# Altium schematic sheet Urukul_DIOT_Connectors_P1_P6.SchDoc: Fastino
size 420 x 297 mm; SPICEModelCacheRMUUFYQV: <root> / <DocumentId>RMUUFYQV</DocumentId> / <CacheFrame Number="0"> / <Model Name="kpp" Kind="GlobalParam"> / <Text>.param KPP = 3.0E-05</Text> / </Model> / <Model Name="ldp" Kind="GlobalParam"> / <Text>.param LDP = 0.07U</Text> / </Model> / <Model Name="vtop" Kind="GlobalParam"> / <Text>.param VTOP = 0.14</Text> / </Model> / <Model Name="rpar" Kind="GlobalParam"> / <Text>.param RPAR = 1T</Text> / </Model> / <Model Name="cbdj" Kind="GlobalParam"> / <Text>.param CBDJ = 1</Text> / </Model> / <Model Name="cn" Kind="GlobalParam"> / <Text>.param CN = 0.8</Text> / </Model> / <Model Name="cjp" Kind="GlobalParam"> / <Text>.param CJP = CN*300U</Text> / <Dependency>0\cn</Dependency> / </Model> / <Model Name="ls" Kind="GlobalParam"> / <Text>.param LS = 1.0U</Text> / </Model> / <Model Name="cbds" Kind="GlobalParam"> / <Text>.param CBDS = 1</Text> / </Model> / <Model Name="cjswp" Kind="GlobalParam"> / <Text>.param CJSWP = CN*2.2N</Text> / <Dependency>0\cn</Dependency> / </Model> / <Model Name="epssio2" Kind="GlobalParam"> / <Text>.param EPSSIO2 = 3.9*8.854214871E-12</Text> / </Model> / <Model Name="tox" Kind="GlobalParam"> / <Text>.param TOX = 1000E-10</Text> / </Model> / <Model Name="cox" Kind="GlobalParam"> / <Text>.param COX = EPSSIO2/TOX</Text> / <Dependency>0\epssio2</Dependency> / <Dependency>0\tox</Dependency> / </Model> / <Model Name="xjn" Kind="GlobalParam"> / <Text>.param XJN = 0.2U</Text> / </Model> / <Model Name="cgsop" Kind="GlobalParam"> / <Text>.param CGSOP = CN*0.6 * XJN * COX</Text> / <Dependency>0\cn</Dependency> / <Dependency>0\xjn</Dependency> / <Dependency>0\cox</Dependency> / </Model> / <Model Name="cgdop" Kind="GlobalParam"> / <Text>.param CGDOP = CGSOP</Text> / <Dependency>0\cgsop</Dependency> / </Model> / <Model Name="isz" Kind="GlobalParam"> / <Text>.param ISZ = 5P</Text> / </Model> / <Model Name="kpn" Kind="GlobalParam"> / <Text>.param KPN = 6.0E-05</Text> / </Model> / <Model Name="ldn" Kind="GlobalParam"> / <Text>.param LDN = 0.07U</Text> / </Model> / <Model Name="rsw" Kind="GlobalParam"> / <Text>.param RSW = 1810</Text> / </Model> / <Model Name="rsn" Kind="GlobalParam"> / <Text>.param RSN = 1.41</Text> / </Model> / <Model Name="vbmul" Kind="GlobalParam"> / <Text>.param VBMUL = 1E6</Text> / </Model> / <Model Name="vtohp" Kind="GlobalParam"> / <Text>.param VTOHP = 0.85</Text> / </Model> / <Model Name="lambda" Kind="GlobalParam"> / <Text>.param LAMBDA = 2M</Text> / </Model> / <Model Name="vtohn" Kind="GlobalParam"> / <Text>.param VTOHN = 0.80</Text> / </Model> / <Model Name="ibias" Kind="CKT"> / <Text>* / .SUBCKT IBIAS VCC GND VIB / * / .PARAM M1 = 8 / .PARAM M2 = 5 / .PARAM MP = 1 / .PARAM WP = 13U / .PARAM WN = 130U / .PARAM LPE = {36U - LDP} / .PARAM LNE = {13U - LDN} / .PARAM BP = {MP*(WP/LPE)*(KPP/2)} / .PARAM WW = 13U / .PARAM LW = 213U / .PARAM WNN = 25U / .PARAM LNN = 87U / .PARAM R1 = {(RSW*LW/WW + RSN*LNN/WNN)} / .PARAM K2 = {M2*(WN/LNE)*(KPN/2)} / .PARAM MR = {M2/M1} / * / R1 VIB GND {VBMUL} / GB  VCC VIB  VALUE = {LIMIT( IF ( V(VCC,GND) &gt; VTOHP, BP*PWR(V(VCC,GND)-VTOHP, 2), 0), / + (1 + 1*LAMBDA*(V(VCC,GND) - VTOHN))*PWR(( 1 - SQRT(MR/(1+2*LAMBDA*(V(VCC,GND) - VTOHP))) )/R1, 2)/K2, 0)} / R2 VIB VCC {RPAR} / .ENDS</Text> / <Dependency>0\kpp</Dependency> / <Dependency>0\kpn</Dependency> / <Dependency>0\ldn</Dependency> / <Dependency>0\ldp</Dependency> / <Dependency>0\rsw</Dependency> / <Dependency>0\rsn</Dependency> / <Dependency>0\vbmul</Dependency> / <Dependency>0\vtohp</Dependency> / <Dependency>0\lambda</Dependency> / <Dependency>0\vtohn</Dependency> / <Dependency>0\rpar</Dependency> / </Model> / <Model Name="vton" Kind="GlobalParam"> / <Text>.param VTON = 0.14</Text> / </Model> / <Model Name="cjn" Kind="GlobalParam"> / <Text>.param CJN = CN*180U</Text> / <Dependency>0\cn</Dependency> / </Model> / <Model Name="cjswn" Kind="GlobalParam"> / <Text>.param CJSWN = CN*1N</Text> / <Dependency>0\cn</Dependency> / </Model> / <Model Name="cgson" Kind="GlobalParam"> / <Text>.param CGSON = CN*0.6 * XJN * COX</Text> / <Dependency>0\cn</Dependency> / <Dependency>0\xjn</Dependency> / <Dependency>0\cox</Dependency> / </Model> / <Model Name="cgdon" Kind="GlobalParam"> / <Text>.param CGDON = CGSON</Text> / <Dependency>0\cgson</Dependency> / </Model> / <Model Name="tlc55x_rwelld" Kind="CKT"> / <Text>*$ / .SUBCKT TLC55X_RWELLD  1 2 PARAMS: W = 10U L = 100U / R1 1 2 {RSW*L/W} / .ENDS</Text> / <Dependency>0\rsw</Dependency> / </Model> / <Model Name="tlc55x_rwell" Kind="CKT"> / <Text>*+ RSH= 10 / *$ / .SUBCKT TLC55X_RWELL  1 2 PARAMS: W = 10U L = 100U / XR1 1 2 TLC55X_RWELLD PARAMS: W = {W} L = {L} / .ENDS</Text> / <Dependency>0\tlc55x_rwelld</Dependency> / </Model> / <Model Name="mdswn" Kind="CKT"> / <Text>.SUBCKT MDSWN D S DG GND PARAMS: W = 100U L = 10U M = 1 / * / .PARAM LE = {L - LDN} / * / S1 D S DG GND SWN / C1 D S {M*(CBDJ*CJN*LS*W + CBDS*CJSWN*(2*LS + W))} / *D B / .MODEL SWN VSWITCH ( VON = {0.55} VOFF = {0.49} RON={1/(2*M*(W/LE)*(KPN/2)*10)} ROFF={1G} ) / .ENDS</Text> / <Dependency>0\kpn</Dependency> / <Dependency>0\ldn</Dependency> / <Dependency>0\cbdj</Dependency> / <Dependency>0\cjn</Dependency> / <Dependency>0\ls</Dependency> / <Dependency>0\cbds</Dependency> / <Dependency>0\cjswn</Dependency> / </Model> / <Model Name="ccg" Kind="GlobalParam"> / <Text>.param CCG = 0.2</Text> / </Model> / <Model Name="xjncg" Kind="GlobalParam"> / <Text>.param XJNCG = 0.2U</Text> / </Model> / <Model Name="toxcg" Kind="GlobalParam"> / <Text>.param TOXCG = 1000E-10</Text> / </Model> / <Model Name="coxcg" Kind="GlobalParam"> / <Text>.param COXCG = EPSSIO2/TOXCG</Text> / <Dependency>0\epssio2</Dependency> / <Dependency>0\toxcg</Dependency> / </Model> / <Model Name="cgsoncg" Kind="GlobalParam"> / <Text>.param CGSONCG = CCG*0.6 * XJNCG * COXCG</Text> / <Dependency>0\ccg</Dependency> / <Dependency>0\xjncg</Dependency> / <Dependency>0\coxcg</Dependency> / </Model> / <Model Name="cgdoncg" Kind="GlobalParam"> / <Text>.param CGDONCG = CGSONCG</Text> / <Dependency>0\cgsoncg</Dependency> / </Model> / <Model Name="cjncg" Kind="GlobalParam"> / <Text>.param CJNCG = CCG*180U</Text> / <Dependency>0\ccg</Dependency> / </Model> / <Model Name="cjswncg" Kind="GlobalParam"> / <Text>.param CJSWNCG = CCG*1N</Text> / <Dependency>0\ccg</Dependency> / </Model> / <Model Name="vtomp" Kind="GlobalParam"> / <Text>.param VTOMP = 0.6</Text> / </Model> / <Model Name="tlc55x_pmosd_mv" Kind="MDL"> / <Text>*$ / .MODEL TLC55X_PMOSD_MV PMOS LEVEL=1 L=10U W=100U KP={KPP} VTO={-VTOMP} LAMBDA=2E-3 / *+ CJ={CJP} CJSW={CJSWP} CGSO={CGSOP} CGDO={CGDOP} PB=0.65 LD=70N TOX={TOX} / + CJ={CJNCG} CJSW={CJSWNCG} CGSO={CGSONCG} CGDO={CGDONCG} PB=0.65 LD= 70N TOX={TOXCG}</Text> / <Dependency>0\cgdoncg</Dependency> / <Dependency>0\cgsoncg</Dependency> / <Dependency>0\cjncg</Dependency> / <Dependency>0\cjswncg</Dependency> / <Dependency>0\kpp</Dependency> / <Dependency>0\toxcg</Dependency> / <Dependency>0\vtomp</Dependency> / </Model> / <Model Name="tlc55x_pmos_mv" Kind="CKT"> / <Text>*$ / .SUBCKT TLC55X_PMOS_MV  D G S B PARAMS: W = 100U L = 10U M = 1 / M1 D G S B TLC55X_PMOSD_MV W = {W} L = {L} M = {M} AD={W*LS} AS={W*LS} PD={W + 2*LS} PS={W + 2*LS} / + NRD={LS/W} NRS={LS/W} / .ENDS</Text> / <Dependency>0\tlc55x_pmosd_mv</Dependency> / <Dependency>0\ls</Dependency> / </Model> / <Model Name="mdswp" Kind="CKT"> / <Text>.SUBCKT MDSWP D S DG GND PARAMS: W = 100U L = 10U M = 1 / * / .PARAM LE = {L - LDP} / * / S1 D S DG GND SWN / C1 D S {M*(CBDJ*CJP*LS*W + CBDS*CJSWP*(2*LS + W))} / *D B / .MODEL SWN VSWITCH ( VON = {0.49} VOFF = {0.55} RON={1/(2*M*(W/LE)*(KPP/2)*10)} ROFF={1G} ) / .ENDS</Text> / <Dependency>0\kpp</Dependency> / <Dependency>0\ldp</Dependency> / <Dependency>0\cbdj</Dependency> / <Dependency>0\cjp</Dependency> / <Dependency>0\ls</Dependency> / <Dependency>0\cbds</Dependency> / <Dependency>0\cjswp</Dependency> / </Model> / <Model Name="comp2inpnorsd" Kind="CKT"> / <Text>.SUBCKT COMP2INPNORSD IN1+ IN1- IN2+ IN2- OUT GND / + PARAMS: ROUT=0 DELAYLH=0 DELAYHL=0 VOUTH=0 VOUTL=0 VTHRES1=0 VTHRES2=0 / * / .PARAM TDELLH = {IF ( (DELAYLH &lt; 1E-9) , 1E-9, DELAYLH ) } / .PARAM TDELHL = {IF ( (DELAYHL &lt; 1E-9) , 1E-9, DELAYHL ) } / .PARAM RO = {IF ( (TDEL &gt; 1E-15) &amp; (ROUT &lt; 1), 1, ROUT ) } / .PARAM TDEL = {(TDELLH+TDELHL)/2} / .PARAM COUT={TDEL/(0.693*(RO+1U))} / .PARAM RDELLH = {TDELLH/(0.693*(COUT+1F))} / .PARAM RDELHL = {TDELHL/(0.693*(COUT+1F))} / EOUT OUT GND VALUE= { IF ( (V(IN1+,IN1-) &gt; {VTHRES1}) | (V(IN2+,IN2-) &gt; {VTHRES2}), / + VOUTL + RDELLH*I(EOUT), VOUTH + RDELHL*I(EOUT) ) } / COUT OUT GND {COUT} / .ENDS COMP2INPNORSD</Text> / </Model> / <Model Name="comp3inpnorsd" Kind="CKT"> / <Text>.SUBCKT COMP3INPNORSD IN1+ IN1- IN2+ IN2- IN3+ IN3- OUT VCC GND / + PARAMS: ROUT=0 DELAYLH=0 DELAYHL=0 VOUTH=0 VOUTL=0 VTHRES1=0 VHYST1=0 VTHRES2=0 VHYST2=0 VTHRES3=0 VHYST3=0 / * / .PARAM TDELLH = {IF ( (DELAYLH &lt; 1E-9) , 1E-9, DELAYLH ) } / .PARAM TDELHL = {IF ( (DELAYHL &lt; 1E-9) , 1E-9, DELAYHL ) } / .PARAM RO = {IF ( (TDEL &gt; 1E-15) &amp; (ROUT &lt; 1), 1, ROUT ) } / .PARAM TDEL = {(TDELLH+TDELHL)/2} / .PARAM COUT={TDEL/(0.693*(RO+1U))} / .PARAM VREFN = {(15-VTOHN)} / .PARAM VREFP = {(15-VTOHP)} / .PARAM RDELLH = {TDELLH/(0.693*(COUT+1F))*VREFP} / .PARAM RDELHL = {TDELHL/(0.693*(COUT+1F))*VREFN} / * / EOUT OUT GND VALUE= { IF ( (V(IN1+,IN1-) &gt; {VTHRES1}) | (V(IN2+,IN2-) &gt; {VTHRES2}) | (V(IN3+,IN3-) &gt; {VTHRES3}), / + VOUTL + RDELLH*I(EOUT)*V(1,GND), VOUTH + RDELHL*I(EOUT)*V(1,GND) ) } / E1 1 GND VALUE= { IF ( (V(VCC,GND) &gt; {VTOHP+0.01}), 1/(V(VCC,GND)-VTOHP), 100 ) } / COUT OUT GND {COUT} / .ENDS COMP3INPNORSD</Text> / <Dependency>0\vtohn</Dependency> / <Dependency>0\vtohp</Dependency> / </Model> / <Model Name="rr1sff" Kind="CKT"> / <Text>.SUBCKT RR1SFF S R R1 Q  Q_ VCC GND / + PARAMS: VOUTH=5.0 VOUTL=0 RIN=1E12 DELAY=10N ROUT=10 / .PARAM W1 = 100U / .PARAM L1 = 10U / .PARAM W2 = 100U / .PARAM L2= 10U / .PARAM W3 = 10U / .PARAM L3 = 25U / .PARAM W4 = 10U / .PARAM L4= 100U / * / XU1     Q GND S GND Q_ GND   COMP2INPNORSD / + PARAMS: ROUT={ROUT} DELAYLH={1N} DELAYHL={1N} VOUTH={VOUTH} VOUTL={VOUTL} / + VTHRES1={0.5*(VOUTH-VOUTL)} VTHRES2={VTOCN} / XU2     VCC R R1 GND Q_ GND Q VCC GND   COMP3INPNORSD / + PARAMS: ROUT={ROUT} DELAYLH={15N} DELAYHL={1N} VOUTH={VOUTH} VOUTL={VOUTL} / + VTHRES1={VTOCP} VTHRES2={VTOCN} VTHRES3={0.49*(VOUTH-VOUTL)} / *C1 S GND {0.5*COX*(W1*L1) + CGSON*W1} / *C2 R VCC {0.5*COX*(W2*L2) + CGSOP*W2} / *C3 R1 GND {0.5*COX*(W3*L3) + CGSON*W3} / *C4 R1 VCC {0.5*COX*(W4*L4) + CGSOP*W4} / .ENDS</Text> / <Dependency>0\comp2inpnorsd</Dependency> / <Dependency>0\comp3inpnorsd</Dependency> / </Model> / <Model Name="vtomn" Kind="GlobalParam"> / <Text>.param VTOMN = 0.55</Text> / </Model> / <Model Name="tlc55x_nmosd_mv" Kind="MDL"> / <Text>*$ / .MODEL TLC55X_NMOSD_MV NMOS LEVEL=1 L=10U W=100U KP={KPN} VTO={VTOMN} LAMBDA=2E-3 / + CJ={CJNCG} CJSW={CJSWNCG} CGSO={CGSONCG} CGDO={CGDONCG} PB=0.65 LD= 70N TOX={TOXCG}</Text> / <Dependency>0\cgdoncg</Dependency> / <Dependency>0\cgsoncg</Dependency> / <Dependency>0\cjncg</Dependency> / <Dependency>0\cjswncg</Dependency> / <Dependency>0\kpn</Dependency> / <Dependency>0\toxcg</Dependency> / <Dependency>0\vtomn</Dependency> / </Model> / <Model Name="tlc55x_nmos_mv" Kind="CKT"> / <Text>*$ / .SUBCKT TLC55X_NMOS_MV  D G S B PARAMS: W = 100U L = 10U M = 1 / M1 D G S B TLC55X_NMOSD_MV W = {W} L = {L} M = {M} AD={W*LS} AS={W*LS} PD={W + 2*LS} PS={W + 2*LS} / + NRD={LS/W} NRS={LS/W} / .ENDS</Text> / <Dependency>0\tlc55x_nmosd_mv</Dependency> / <Dependency>0\ls</Dependency> / </Model> / <Model Name="mswn" Kind="CKT"> / <Text>.SUBCKT MSWN D G S PARAMS: W = 100U L = 10U M = 1 / * / .PARAM LE = {L - LDN} / * / *C1 D S {M*(CBDJ*CJN*LS*W + CBDS*CJSWN*(2*LS + W))} / *D B / *C2 G S {M*2/3*COX*(W*LE) + CGSON*W} / *C3 G D {CGDON*W} / S1 D S G S SWN / .MODEL SWN VSWITCH ( VON = {VTON+1} VOFF = {VTON} RON={1/(2*M*(W/L)*(KPN/2)*10)} ROFF={1G} ) / .ENDS</Text> / <Dependency>0\vton</Dependency> / <Dependency>0\kpn</Dependency> / <Dependency>0\ldn</Dependency> / </Model> / <Model Name="tlc55x_nmosd_hv" Kind="MDL"> / <Text>*$ / .MODEL TLC55X_NMOSD_HV NMOS LEVEL=3 L=10U W=100U KP={KPN} VTO={VTOHN} LAMBDA=2E-3 THETA=1.8E-01 / + CJ={CJN} CJSW={CJSWN} CGSO={CGSON} CGDO={CGDON} RSH= 10 PB=0.65 LD= 70N TOX={TOX}</Text> / <Dependency>0\cgdon</Dependency> / <Dependency>0\cgson</Dependency> / <Dependency>0\cjn</Dependency> / <Dependency>0\cjswn</Dependency> / <Dependency>0\kpn</Dependency> / <Dependency>0\tox</Dependency> / <Dependency>0\vtohn</Dependency> / </Model> / <Model Name="tlc55x_nmos_hv" Kind="CKT"> / <Text>.SUBCKT TLC55X_NMOS_HV  D G S B PARAMS: W = 100U L = 10U M = 1 / M1 D G S B TLC55X_NMOSD_HV W = {W} L = {L} M = {M} AD={W*LS} AS={W*LS} PD={W + 2*LS} PS={W + 2*LS} / + NRD={LS/W} NRS={LS/W} / .ENDS</Text> / <Dependency>0\tlc55x_nmosd_hv</Dependency> / <Dependency>0\ls</Dependency> / </Model> / <Model Name="tlc55x_pmosd_hv" Kind="MDL"> / <Text>*$ / .MODEL TLC55X_PMOSD_HV PMOS LEVEL=3 L=10U W=100U KP={KPP} VTO={-VTOHP} LAMBDA=2E-3 THETA=2.2E-01 / + CJ={CJP} CJSW={CJSWP} CGSO={CGSOP} CGDO={CGDOP} RSH=10 PB=0.65 LD=70N TOX={TOX}</Text> / <Dependency>0\cgdop</Dependency> / <Dependency>0\cgsop</Dependency> / <Dependency>0\cjp</Dependency> / <Dependency>0\cjswp</Dependency> / <Dependency>0\kpp</Dependency> / <Dependency>0\tox</Dependency> / <Dependency>0\vtohp</Dependency> / </Model> / <Model Name="tlc55x_pmos_hv" Kind="CKT"> / <Text>*+ RSH= 10 / *$ / .SUBCKT TLC55X_PMOS_HV  D G S B PARAMS: W = 100U L = 10U M = 1 / M1 D G S B TLC55X_PMOSD_HV W = {W} L = {L} M = {M} AD={W*LS} AS={W*LS} PD={W + 2*LS} PS={W + 2*LS} / + NRD={LS/W} NRS={LS/W} / .ENDS</Text> / <Dependency>0\tlc55x_pmosd_hv</Dependency> / <Dependency>0\ls</Dependency> / </Model> / <Model Name="tlc55x_nmosd_hv_l1" Kind="MDL"> / <Text>*$ / .MODEL TLC55X_NMOSD_HV_L1 NMOS LEVEL=1 L=10U W=100U KP={KPN} VTO={VTOHN} LAMBDA=2E-3 / + CJ={CJN} CJSW={CJSWN} CGSO={CGSON} CGDO={CGDON} RSH= 10 PB=0.65 LD= 70N TOX={TOX}</Text> / <Dependency>0\cgdon</Dependency> / <Dependency>0\cgson</Dependency> / <Dependency>0\cjn</Dependency> / <Dependency>0\cjswn</Dependency> / <Dependency>0\kpn</Dependency> / <Dependency>0\tox</Dependency> / <Dependency>0\vtohn</Dependency> / </Model> / <Model Name="tlc55x_nmos_hv_l1" Kind="CKT"> / <Text>*$ / .SUBCKT TLC55X_NMOS_HV_L1  D G S B PARAMS: W = 100U L = 10U M = 1 / M1 D G S B TLC55X_NMOSD_HV_L1 W = {W} L = {L} M = {M} AD={W*LS} AS={W*LS} PD={W + 2*LS} PS={W + 2*LS} / + NRD={LS/W} NRS={LS/W} / .ENDS</Text> / <Dependency>0\tlc55x_nmosd_hv_l1</Dependency> / <Dependency>0\ls</Dependency> / </Model> / <Model Name="tlc55x_pmosd_lv" Kind="MDL"> / <Text>*+ RSH= 10 / *$ / .MODEL TLC55X_PMOSD_LV PMOS LEVEL=1 L=10U W=100U KP={KPP} VTO={-VTOP} LAMBDA=2E-3 / + CJ={CJP} CJSW={CJSWP} CGSO={CGSOP} CGDO={CGDOP}  PB=0.65 LD=300N TOX={TOX}</Text> / <Dependency>0\cgdop</Dependency> / <Dependency>0\cgsop</Dependency> / <Dependency>0\cjp</Dependency> / <Dependency>0\cjswp</Dependency> / <Dependency>0\kpp</Dependency> / <Dependency>0\tox</Dependency> / <Dependency>0\vtop</Dependency> / </Model> / <Model Name="tlc55x_pmos_lv" Kind="CKT"> / <Text>*$ / .SUBCKT TLC55X_PMOS_LV  D G S B PARAMS: W = 100U L = 10U M = 1 / M1 D G S B TLC55X_PMOSD_LV W = {W} L = {L} M = {M} AD={W*LS} AS={W*LS} PD={W + 2*LS} PS={W + 2*LS} / + NRD={LS/W} NRS={LS/W} / .ENDS</Text> / <Dependency>0\tlc55x_pmosd_lv</Dependency> / <Dependency>0\ls</Dependency> / </Model> / <Model Name="pk14" Kind="CKT"> / <Text>*.INC dhvqfn.s / .SUBCKT pk14 / +    1   2   3   4   5   6   7   8   9  10 / +   11  12  13  14 / +   15  16  17  18  19  20  21  22  23  24 / +   25  26  27  28 / * Pin Resistance / r1 1 1001 9.078E-02 / r2 2 1002 8.829E-02 / r3 3 1003 8.731E-02 / r4 4 1004 8.710E-02 / r5 5 1005 8.731E-02 / r6 6 1006 8.829E-02 / r7 7 1007 9.075E-02 / r8 8 1008 9.072E-02 / r9 9 1009 8.809E-02 / r10 10 1010 8.716E-02 / r11 11 1011 8.706E-02 / r12 12 1012 8.720E-02 / r13 13 1013 8.816E-02 / r14 14 1014 9.068E-02 / * Pin Inductance / l1 1001 15 2.981E-09 / l2 1002 16 2.447E-09 / l3 1003 17 2.304E-09 / l4 1004 18 2.291E-09 / l5 1005 19 2.307E-09 / l6 1006 20 2.449E-09 / l7 1007 21 2.971E-09 / l8 1008 22 2.972E-09 / l9 1009 23 2.425E-09 / l10 1010 24 2.286E-09 / l11 1011 25 2.280E-09 / l12 1012 26 2.286E-09 / l13 1013 27 2.425E-09 / l14 1014 28 2.975E-09 / .ENDS pk14</Text> / </Model> / <Model Name="vt" Kind="GlobalParam"> / <Text>.param VT = 1.380649e-23*(273.15+TEMP)/1.60217662e-19</Text> / </Model> / </CacheFrame> / <CacheFrame Number="1"> / <Model Name="iimirrp" Kind="CKT"> / <Text>.SUBCKT IIMIRRP VCC IO II PARAMS: W1 = 100U L1 = 10U M1 = 1 W2 = 100U L2= 10U M2 = 2 IDIN = 1U / * / .PARAM L1E = {L1 - LDP} / .PARAM L2E = {L2 - LDP} / .PARAM B1 = {M1*(W1/L1)*(KPP/2)} / .PARAM MR = {M2*W2/L2E/(M1*W1/L1E)} / .PARAM RDS = {1/(2*SQRT(M2*(W2/L2E)*(KPP/2)*IDIN))} / .PARAM IS = 1E-12 / .PARAM NP = {VTOP/(VT*Log(1 + IDIN/IS))} / * / FB VCC IO V1 {MR} / R1 VCC IO {RPAR} / C1 VCC IO {M2*(CBDJ*CJP*LS*W2 + CBDS*CJSWP*(2*LS + W2))} / D1 IO  10  DMODP / V1 VCC 10 {VTOP} / R2 II 10  {RDS} / C2 VCC II {M1*(CBDJ*CJP*LS*W1 + CBDS*CJSWP*(2*LS + W1)) + 2/3*COX*(M1*W1*L1E + M2*W2*L2E) + M1*CGSOP*W1} / C3 II IO {CGDOP*W2} / .MODEL DMODP D (IS={IS} N={NP} ) / .ENDS</Text> / <Dependency>0\kpp</Dependency> / <Dependency>0\ldp</Dependency> / <Dependency>0\vtop</Dependency> / <Dependency>0\vt</Dependency> / <Dependency>0\rpar</Dependency> / <Dependency>0\cbdj</Dependency> / <Dependency>0\cjp</Dependency> / <Dependency>0\ls</Dependency> / <Dependency>0\cbds</Dependency> / <Dependency>0\cjswp</Dependency> / <Dependency>0\cox</Dependency> / <Dependency>0\cgsop</Dependency> / <Dependency>0\cgdop</Dependency> / </Model> / <Model Name="nz" Kind="GlobalParam"> / <Text>.param NZ = 0.3/(VT*Log(1 + 5.0M/ISZ))</Text> / <Dependency>0\vt</Dependency> / <Dependency>0\isz</Dependency> / </Model> / <Model Name="dz_18v" Kind="MDL"> / <Text>.MODEL DZ_18V D( IS={ISz} N={Nz} BV=18.0 IBV=5.0M EG={8*Nz*VT})</Text> / <Dependency>0\isz</Dependency> / <Dependency>1\nz</Dependency> / <Dependency>0\vt</Dependency> / </Model> / <Model Name="d_z18v" Kind="CKT"> / <Text>* / * CONNECTIONS:   A / *                |    C / *                |    | / .SUBCKT D_Z18V   1    2 / D1 1 2  DZ_18V / .ENDS</Text> / <Dependency>1\dz_18v</Dependency> / </Model> / <Model Name="iimirrn" Kind="CKT"> / <Text>.SUBCKT IIMIRRN GND IO II PARAMS: W1 = 100U L1 = 10U M1 = 1 W2 = 100U L2= 10U M2 = 2 IDIN = 1U / * / .PARAM L1E = {L1 - LDN} / .PARAM L2E = {L2 - LDN} / .PARAM B1 = {M1*(W1/L1)*(KPN/2)} / .PARAM MR = { M2*W2/L2E/(M1*W1/L1E) } / .PARAM RDS = {1/(2*SQRT(M2*(W2/L2E)*(KPN/2)*IDIN))} / .PARAM IS = 1E-12 / .PARAM NN = {VTON/(VT*Log(1 + IDIN/IS))} / * / FB IO GND V1 {MR} / R1 IO GND {RPAR} / C1 IO GND {M2*(CBDJ*CJN*LS*W2 + CBDS*CJSWN*(2*LS + W2))} / D1 10 IO  DMODN / V1 10 GND {VTON} / R2 II 10  {RDS} / C2 II GND {M1*(CBDJ*CJN*LS*W1 + CBDS*CJSWN*(2*LS + W1)) + 2/3*COX*(M1*W1*L1E + M2*W2*L2E) + M1*CGSON*W1} / C3 II IO {M2*CGDON*W2} / .MODEL DMODN D (IS={IS} N={NN} ) / .ENDS</Text> / <Dependency>0\kpn</Dependency> / <Dependency>0\ldn</Dependency> / <Dependency>0\vton</Dependency> / <Dependency>0\vt</Dependency> / <Dependency>0\rpar</Dependency> / <Dependency>0\cbdj</Dependency> / <Dependency>0\cjn</Dependency> / <Dependency>0\ls</Dependency> / <Dependency>0\cbds</Dependency> / <Dependency>0\cjswn</Dependency> / <Dependency>0\cox</Dependency> / <Dependency>0\cgson</Dependency> / <Dependency>0\cgdon</Dependency> / </Model> / <Model Name="imirrp" Kind="CKT"> / <Text>.SUBCKT IMIRRP VCC IO VIB GND PARAMS: W = 100U L = 10U M = 1 IO = 1U / * / .PARAM MP = 1 / .PARAM WP = 13U / .PARAM LPE = {36U - LDP} / .PARAM LE = {L - LDP} / .PARAM MR = { M*W/LE/(MP*WP/LPE)/VBMUL } / .PARAM B1 = { (KPP/2*MP*WP/LPE)*VBMUL } / .PARAM IS = 1E-12 / .PARAM N = {VTOHP/(VT*Log(1 + IO/IS))} / * / GB VCC IO VIB GND {MR} / R1 VCC IO {RPAR} / C1 VCC IO {M*(CBDJ*CJP*LS*W + CBDS*CJSWP*(2*LS + W))} / V1 VCC 10 {VTOHP} / D1 IO  10  DMOD1 / .MODEL DMOD1 D (IS={IS} N={N} ) / .ENDS</Text> / <Dependency>0\kpp</Dependency> / <Dependency>0\vbmul</Dependency> / <Dependency>0\ldp</Dependency> / <Dependency>0\vtohp</Dependency> / <Dependency>0\vt</Dependency> / <Dependency>0\rpar</Dependency> / <Dependency>0\cbdj</Dependency> / <Dependency>0\cjp</Dependency> / <Dependency>0\ls</Dependency> / <Dependency>0\cbds</Dependency> / <Dependency>0\cjswp</Dependency> / </Model> / <Model Name="tlc555" Kind="CKT"> / <Text>.SUBCKT TLC555 THRES CONT TRIG RESET OUT DISC VCC GND / XD8          GND RESI   D_Z18V / XD7          GND RESET   D_Z18V / XR2          RESET RESI   TLC55X_RWELL / + PARAMS: W=50u L=20u / XD2          GND TRGI   D_Z18V / XD1          GND TRIG   D_Z18V / XR3          TRIG TRGI   TLC55X_RWELL / + PARAMS: W=50u L=20u / XD4          GND THRI   D_Z18V / XD3          GND THRES   D_Z18V / XR2_2        THRES THRI   TLC55X_RWELL / + PARAMS: W=50u L=20u / XD6          GND CONTI   D_Z18V / XD5          GND CONT   D_Z18V / XR2_3        CONT CONTI   TLC55X_RWELL / + PARAMS: W=50u L=20u / XMN15        GOUT GND QFF GND   MDSWN / + PARAMS: W=100U L=10U M=7 / XMP15        GOUT VCC QFF GND   MDSWP / + PARAMS: W=195U L=10U M=9 / XMN3         GND TRGO 23   IIMIRRN / + PARAMS: W1=170U L1=18U M1=1 W2=170U L2=18U M2=1 IDIN=1U / XMN5         GND THRS 25   IIMIRRN / + PARAMS: W1=13U L1=26U M1=1 W2=52U L2=13U M2=2 IDIN=50N / XMp9         VCC RESO 15 GND   IMIRRP / + PARAMS: W=112U L=15U M=2 IO=2U / XMp6         VCC 25 15 GND   IMIRRP / + PARAMS: W=18U L=26U M=1 IO=100n / XMp5         VCC TRGS 15 GND   IMIRRP / + PARAMS: W=112U L=15U M=2 IO=2U / XMp1         VCC THRO 29   IIMIRRP / + PARAMS: W1=172U L1=15U M1=1 W2=172U L2=15U M2=1 IDIN=1U / XIB          VCC GND 15   IBIAS / XRSFF        TRGO THRO RESO QFF 30 VCC GND   RR1SFF / + PARAMS: VOUTH=1 VOUTL=0 RIN=1E12 DELAY=30N ROUT=10 / XMN9         TRGO RESO GND   MSWN / + PARAMS: W=100U L=10U M=1 / XMN17        DISC GOUT GND GND   TLC55X_NMOS_HV / + PARAMS: W=350U L=10U M=20 / XMN16        OUT GOUT GND GND   TLC55X_NMOS_HV / + PARAMS: W=175U L=10U M=20 / XMP16        OUT GOUT VCC VCC   TLC55X_PMOS_HV / + PARAMS: W=270u L=10u M=7 / XMN10        RESO RESI GND GND   TLC55X_NMOS_HV_L1 / + PARAMS: W=100u L=10u M=1 / XMN2         THRO THRI THRS GND   TLC55X_NMOS_MV / + PARAMS: W=170u L=18u M=2 / XMP4         TRGO TRGI TRGS VCC   TLC55X_PMOS_MV / + PARAMS: W=172u L=15u M=2 / XMP3         23 TRGC TRGS VCC   TLC55X_PMOS_MV / + PARAMS: W=172u L=15u M=2 / XMPR1F       GND GND 32 TRGC   TLC55X_PMOS_LV / + PARAMS: W=20U L=15U M=1 / XMPR1E       32 32 TRGC TRGC   TLC55X_PMOS_LV / + PARAMS: W=20U L=15U M=1 / XMPR1D       TRGC TRGC 33 CONTI   TLC55X_PMOS_LV / + PARAMS: W=20U L=15U M=1 / XMPR1C       33 33 CONTI CONTI   TLC55X_PMOS_LV / + PARAMS: W=20U L=15U M=1 / XMPR1B       CONTI CONTI 34 VCC   TLC55X_PMOS_LV / + PARAMS: W=20u L=15u M=1 / XMPR1A       34 34 VCC VCC   TLC55X_PMOS_LV / + PARAMS: W=20u L=15u M=1 / XMN1         29 CONTI THRS GND   TLC55X_NMOS_MV / + PARAMS: W=170u L=18u M=2 / .ENDS TLC555</Text> / <Dependency>1\iimirrp</Dependency> / <Dependency>1\d_z18v</Dependency> / <Dependency>0\ibias</Dependency> / <Dependency>1\iimirrn</Dependency> / <Dependency>0\tlc55x_rwell</Dependency> / <Dependency>0\mdswn</Dependency> / <Dependency>0\tlc55x_pmos_mv</Dependency> / <Dependency>0\mdswp</Dependency> / <Dependency>1\imirrp</Dependency> / <Dependency>0\rr1sff</Dependency> / <Dependency>0\tlc55x_nmos_mv</Dependency> / <Dependency>0\mswn</Dependency> / <Dependency>0\tlc55x_nmos_hv</Dependency> / <Dependency>0\tlc55x_pmos_hv</Dependency> / <Dependency>0\tlc55x_nmos_hv_l1</Dependency> / <Dependency>0\tlc55x_pmos_lv</Dependency> / </Model> / </CacheFrame> / </root>; Author: G.Kasprowicz; CompanyName: WUT ISE; DrawnBy: G.Kasprowicz; Organization: WUT ISE; Address1: PW ISE; Address2: Nowowiejska 15/19 00-665 Warsaw; Address3: gkasprow@gmail.com; Revision: 2; SheetNumber: 11; SheetTotal: 11; ModifiedBy: -; CheckedDate: -; Title2: DIOT connectors; DivGrp: WUT ISE; Designer: G.Kasprowicz; ModifiedDate: -; ProjectName: Sensor Box
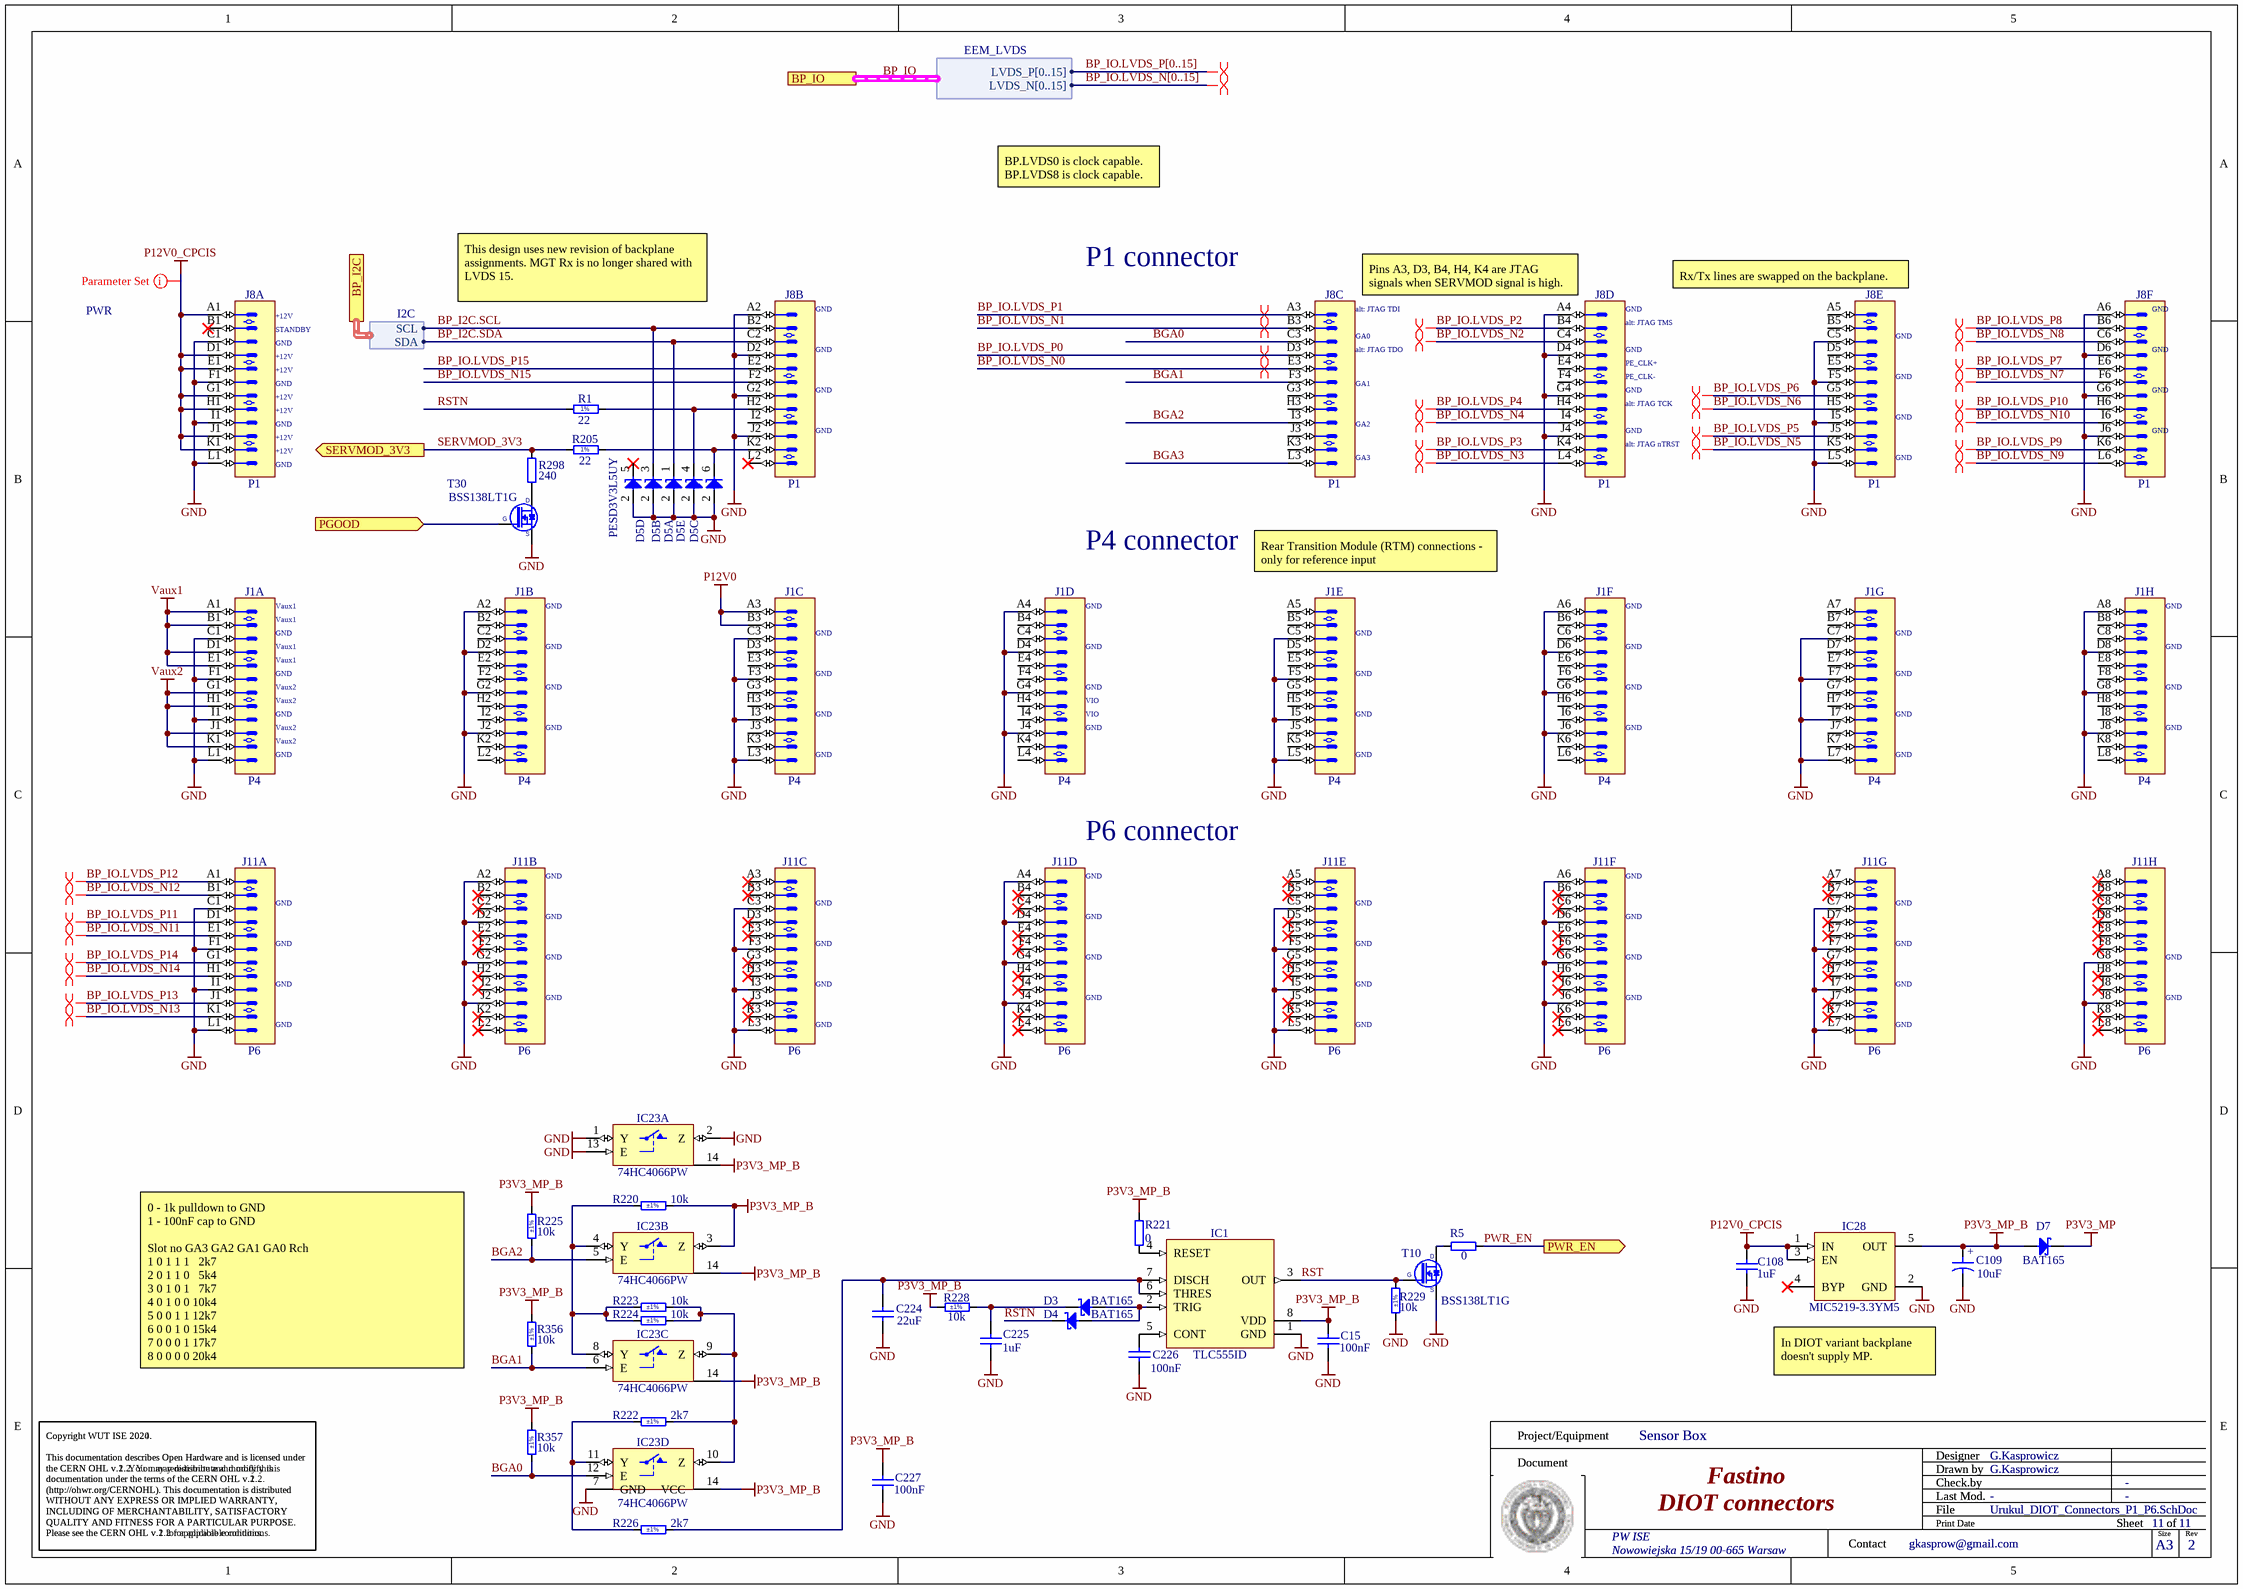
[diagram p0: Urukul_DIOT_Connectors_P1_P6.SchDoc]

## Parts
C15  100nF  [CAPC1005X55N]
C108  1uF  [CAPC1608X87N]
C109  10uF  [CAPMP3216X180N]
C224  22uF  [CAPC1608X90N]
C225  1uF  [CAPC1005X55N]
C226  100nF  [CAPC1005X55N]
C227  100nF  [CAPC1005X55N]
D3  BAT165  [SOD2512X110N]
D4  BAT165  [SOD2512X110N]
D5  PESD3V3L5UY  [SOT65P210X110-6N]  (value not drawn)  (parts A,B,C,D,E of 5)
D7  BAT165  [SOD2512X110N]
IC1  TLC555ID  [SOIC127P600X175-8N]
IC23  74HC4066PW  [SOP65P640X110-14N]  (parts A,B,C,D of 4)
IC28  MIC5219-3.3YM5  [SOT95P280X145-5N]
J1  P4  [AMPHENOL_10052837-101LF]  (parts A,B,C,D,E,F,G,H of 8)
J8  P1  [AMPHENOL_10052825-101LF]  (parts A,B,C,D,E,F of 6)
J11  P6  [AMPHENOL_10052838-101LF]  (parts A,B,C,D,E,F,G,H of 8)
R1  22  [RESC1005X40N]
R5  0  [RESC1005X40N]
R205  22  [RESC1005X40N]
R220  10k  Tolerance: ±1%  [RESC1005X40N]
R221  0  [RESC1005X40N]
R222  2k7  Tolerance: ±1%  [RESC1608X55N]
R223  10k  Tolerance: ±1%  [RESC1005X40N]
R224  10k  Tolerance: ±1%  [RESC1005X40N]
R225  10k  Tolerance: ±1%  [RESC1005X40N]
R226  2k7  Tolerance: ±1%  [RESC1608X55N]
R228  10k  Tolerance: ±1%  [RESC1005X40N]
R229  10k  Tolerance: ±1%  [RESC1005X40N]
R298  240  [RESC1005X40N]
R356  10k  Tolerance: ±1%  [RESC1005X40N]
R357  10k  Tolerance: ±1%  [RESC1005X40N]
T10  BSS138LT1G  [SOT95P240X110-3N]
T30  BSS138LT1G  [SOT95P240X110-3N]

## Ports
BP_I2C (harness I2C), BP_IO (harness EEM_LVDS), PGOOD (in), PWR_EN (out), SERVMOD_3V3 (out)

## Harnesses
I2C: SDA, SCL
EEM_LVDS: LVDS_P[0..15], LVDS_N[0..15]

## Nets
GND: C15.1 C108.1 C109.2 C224.1 C225.1 C226.1 C227.1 D5.2(A) IC1.1(GND) IC23.1(Y) IC23.2(Z) IC23.7(GND) IC23.13(E) IC28.2(GND) J1.A2 J1.A4 J1.A6 J1.A8 J1.C1 J1.C3 J1.C5 J1.C7 J1.D2 J1.D4 J1.D6 J1.D8 J1.F1 J1.F3 J1.F5 J1.F7 J1.G2 J1.G4 J1.G6 J1.G8 J1.I1 J1.I3 J1.I5 J1.I7 J1.J2 J1.J4 J1.J6 J1.J8 J1.L1 J1.L3 J1.L5 J1.L7 J8.A2 J8.A4 J8.A6 J8.C1 J8.C5 J8.D2 J8.D4 J8.D6 J8.F1 J8.F5 J8.G2 J8.G4 J8.G6 J8.I1 J8.I5 J8.J2 J8.J4 J8.J6 J8.L1 J8.L5 J11.A2 J11.A4 J11.A6 J11.C1 J11.C3 J11.C5 J11.C7 J11.D2 J11.D4 J11.D6 J11.F1 J11.F3 J11.F5 J11.F7 J11.G2 J11.G4 J11.G6 J11.G8 J11.I1 J11.I3 J11.I5 J11.I7 J11.J2 J11.J4 J11.J6 J11.J8 J11.L1 J11.L3 J11.L5 J11.L7 R229.1 T10.2(S) T30.2(S)
P3V3_MP: D7.1(C)
P3V3_MP_B: C15.2 C109.1 C227.2 D7.2(A) IC1.8(VDD) IC23.3(Z) IC23.14(VCC) IC28.5(OUT) R220.2 R221.2 R225.2 R228.1 R356.2 R357.2
P12V0: J1.A3 J1.B3
P12V0_CPCIS: C108.2 IC28.1(IN) IC28.3(EN) J8.A1 J8.D1 J8.E1 J8.G1 J8.H1 J8.J1 J8.K1
Vaux1: J1.A1 J1.B1 J1.D1 J1.E1
Vaux2: J1.G1 J1.H1 J1.J1 J1.K1
BGA0: IC23.12(E) J8.C3 R357.1
BGA1: IC23.6(E) J8.F3 R356.1
BGA2: IC23.5(E) J8.I3 R225.1
BGA3: J8.L3
BP_I2C.SCL: D5.3(C) J8.B2 ; port BP_I2C.SCL
BP_I2C.SDA: D5.1(C) J8.C2 ; port BP_I2C.SDA
BP_IO.LVDS_N0: J8.E3
BP_IO.LVDS_N1: J8.B3
BP_IO.LVDS_N2: J8.C4
BP_IO.LVDS_N3: J8.L4
BP_IO.LVDS_N4: J8.I4
BP_IO.LVDS_N5: J8.K5
BP_IO.LVDS_N6: J8.H5
BP_IO.LVDS_N7: J8.F6
BP_IO.LVDS_N8: J8.C6
BP_IO.LVDS_N9: J8.L6
BP_IO.LVDS_N10: J8.I6
BP_IO.LVDS_N11: J11.E1
BP_IO.LVDS_N12: J11.B1
BP_IO.LVDS_N13: J11.K1
BP_IO.LVDS_N14: J11.H1
BP_IO.LVDS_N15: J8.F2
BP_IO.LVDS_P0: J8.D3
BP_IO.LVDS_P1: J8.A3
BP_IO.LVDS_P2: J8.B4
BP_IO.LVDS_P3: J8.K4
BP_IO.LVDS_P4: J8.H4
BP_IO.LVDS_P5: J8.J5
BP_IO.LVDS_P6: J8.G5
BP_IO.LVDS_P7: J8.E6
BP_IO.LVDS_P8: J8.B6
BP_IO.LVDS_P9: J8.K6
BP_IO.LVDS_P10: J8.H6
BP_IO.LVDS_P11: J11.D1
BP_IO.LVDS_P12: J11.A1
BP_IO.LVDS_P13: J11.J1
BP_IO.LVDS_P14: J11.G1
BP_IO.LVDS_P15: J8.E2
PGOOD: T30.1(G) ; port PGOOD
PWR_EN: R5.1 ; port PWR_EN
RST: IC1.3(OUT) R229.2 T10.1(G)
RSTN: D4.1(C) R1.1
SERVMOD_3V3: R205.1 R298.2 ; port SERVMOD_3V3
NetC224_2: C224.2 IC1.6(THRES) IC1.7(DISCH) R226.2
NetC225_2: C225.2 D3.1(C) R228.2
NetC226_2: C226.2 IC1.5(CONT)
NetD3_2: D3.2(A) D4.2(A) IC1.2(TRIG)
NetD5_4: D5.4(C) J8.H2 R1.2
NetD5_6: D5.6(C) J8.K2 R205.2
NetIC1_4: IC1.4(RESET) R221.1
NetIC23_4: IC23.4(Y) IC23.8(Y) R220.1 R223.1 R224.1
NetIC23_9: IC23.9(Z) IC23.10(Z) R222.2 R223.2 R224.2
NetIC23_11: IC23.11(Y) R222.1 R226.1
NetR5_2: R5.2 T10.3(D)
NetR298_1: R298.1 T30.3(D)

Not connected (* = marked no-connect by the designer): D5 5(C)*; IC28 4(BYP)*; J1 A5 A7 B2 B4 B5 B6 B7 B8 C2 C4 C6 C8 D3 D5 D7 E2 E3 E4 E5 E6 E7 E8 F2 F4 F6 F8 G3 G5 G7 H2 H3 H4 H5 H6 H7 H8 I2 I4 I6 I8 J3 J5 J7 K2 K3 K4 K5 K6 K7 K8 L2 L4 L6 L8; J8 A5 B1* B5 D5 E4 E5 F4 G3 H3 I2 J3 K3 L2*; J11 A3* A5* A7* A8* B2* B3* B4* B5* B6* B7* B8* C2* C4* C6* C8* D3* D5* D7* D8* E2* E3* E4* E5* E6* E7* E8* F2* F4* F6* F8* G3* G5* G7* H2* H3* H4* H5* H6* H7* H8* I2* I4* I6* I8* J3* J5* J7* K2* K3* K4* K5* K6* K7* K8* L2* L4* L6* L8*

## Buses and harness runs
bus BP_IO.LVDS_N[0..15]
bus BP_IO.LVDS_P[0..15]
harness BP_IO = port BP_IO

## Layout directives
differential pair: (no net found under the mark), BP_IO.LVDS_N0, BP_IO.LVDS_N1, BP_IO.LVDS_N2, BP_IO.LVDS_N3, BP_IO.LVDS_N4, BP_IO.LVDS_N5, BP_IO.LVDS_N6, BP_IO.LVDS_N7, BP_IO.LVDS_N8, BP_IO.LVDS_N9, BP_IO.LVDS_N10, BP_IO.LVDS_N11, BP_IO.LVDS_N12, BP_IO.LVDS_N13, BP_IO.LVDS_N14, BP_IO.LVDS_P0, BP_IO.LVDS_P1, BP_IO.LVDS_P2, BP_IO.LVDS_P3, BP_IO.LVDS_P4, BP_IO.LVDS_P5, BP_IO.LVDS_P6, BP_IO.LVDS_P7, BP_IO.LVDS_P8, BP_IO.LVDS_P9, BP_IO.LVDS_P10, BP_IO.LVDS_P11, BP_IO.LVDS_P12, BP_IO.LVDS_P13, BP_IO.LVDS_P14
net class PWR: P12V0_CPCIS

## Notes on the sheet
- BP.LVDS0 is clock capable.
  BP.LVDS8 is clock capable.
- (near J8) +12V
- This design uses new revision of backplane assignments. MGT Rx is no longer shared with LVDS 15.
- (near J8) GND
- P1 connector
- (near J8) alt: JTAG TDI
- (near J8) Pins A3, D3, B4, H4, K4 are JTAG signals when SERVMOD signal is high.
- (near J8) alt: JTAG TMS
- (near J8) Rx/Tx lines are swapped on the backplane.
- (near J8) STANDBY
- (near J8) alt: JTAG TDO
- (near J8) GA1
- (near J8) GA0
- (near J8) PE_CLK+
- (near J8) PE_CLK-
- (near J8) GA2
- (near J8) GA3
- (near J8) alt: JTAG TCK
- (near J8) alt: JTAG nTRST
- P4 connector
- (near J1) Rear Transition Module (RTM) connections - only for reference input
- (near J1) Vaux1
- (near J1) GND
- (near J1) Vaux2
- (near J1) VIO
- (near J11) P6 connector
- (near J11) GND
- 0 - 1k pulldown to GND
  1 - 100nF cap to GND
  Slot no	GA3	GA2	GA1	GA0	Rch
  1	0	1	1	1	  2k7
  2	0	1	1	0	  5k4
  3	0	1	0	1	  7k7
  4	0	1	0	0	10k4
  5	0	0	1	1	12k7
  6	0	0	1	0	15k4
  7	0	0	0	1	17k7
  8	0	0	0	0	20k4
- In DIOT variant backplane doesn't supply MP.
- Project/Equipment
- Document
- Designer
- Drawn by
- Check.by
- Copyright WUT ISE 2020.
  This documentation describes Open Hardware and is licensed under the CERN OHL v.1.2. You may redistribute and modify this documentation under the terms of the CERN OHL v.1.2. (http://ohwr.org/CERNOHL). This documentation is distributed WITHOUT ANY EXPRESS OR IMPLIED WARRANTY, INCLUDING OF MERCHANTABILITY, SATISFACTORY QUALITY AND FITNESS FOR A PARTICULAR PURPOSE. Please see the CERN OHL v.1.2 for applicable conditions.
- Copyright WUT ISE 2024.
  This documentation describes Open Hardware and is licensed under the CERN OHL v.2. You may redistribute and modify this documentation under the terms of the CERN OHL v.2. (http://ohwr.org/CERNOHL). This documentation is distributed WITHOUT ANY EXPRESS OR IMPLIED WARRANTY, INCLUDING OF MERCHANTABILITY, SATISFACTORY QUALITY AND FITNESS FOR A PARTICULAR PURPOSE. Please see the CERN OHL v.2 for applicable conditions.
- Contact
- File
- Last Mod.
- Print Date
- Sheet
- Size
- A3
- of
- Rev
- (in symbol CTE3216-18_10UF_16V_20%_AVX_TCJ) +
- (in symbol R0402_22R_1%_0.0625W_100PPM) 1%

## Library data of the parts
C15 C226 C227 = CC0402_100NF_16V_10%_X5R: Non-polarised capacitor; Part Description: SMD Multilayer Chip Ceramic Capacitor; Manufacturer: GENERIC; Manufacturer1 Part Number: GRM155R61C104KA88D; Voltage: 16V; TC: X5R; Tolerance: ±10%; Part Number: CC0402_100NF_16V_10%_X5R; Component Kind: Standard; Component Type: Standard; Pin Count: 2; Value: 100nF; Status: None; Manufacturer Part Number: CC0402_100NF_16V_10%_X5R; Case: 0402; Mounted: Yes; Socket: No; SMD: Yes; Sense: No; Manufacturer1 Example: MURATA; Manufacturer1 ComponentHeight: 0.55mm; HelpURL: \\cern.ch\dfs\Applications\Altium\Datasheets\CC0402_X5R_MURATA_GRM.pdf; Author: CERN DEM JLC; CreateDate: 10.12.2013; LatestRevisionDate: 10.12.2013
C108 = CC0603_1UF_25V_10%_X7R: Non-polarised capacitor; Part Description: SMD Multilayer Chip Ceramic Capacitor; Manufacturer: GENERIC; Manufacturer1 Part Number: GRM188R71E105KA12D; Voltage: 25V; TC: X7R; Tolerance: ±10%; Part Number: CC0603_1UF_25V_10%_X7R; Component Kind: Standard; Component Type: Standard; Pin Count: 2; Value: 1uF; Status: None; Manufacturer Part Number: CC0603_1UF_25V_10%_X7R; Case: 0603; Mounted: Yes; Socket: No; SMD: Yes; Sense: No; Manufacturer1 Example: MURATA; Manufacturer1 ComponentHeight: 0.9mm; HelpURL: \\cern.ch\dfs\Applications\Altium\Datasheets\CC0603_X7R_MURATA.pdf; Author: CERN DEM JLC; CreateDate: 18.01.2011; LatestRevisionDate: 18.01.2011
C109 = CTE3216-18_10UF_16V_20%_AVX_TCJ: Polarised capacitor; Part Description: ESR 0R200 Tantalum Solid Electrolytic Chip Capacitor with Conductive Polymer Electrode; Manufacturer: AVX; Manufacturer Part Number: TCJA106M016R0200 or  or TR3A106K016C1700; Voltage: 16V; Tolerance: ±20%; Part Number: CTE3216-18_10UF_16V_20%_AVX_TCJ; Component Kind: Standard; Component Type: Standard; Pin Count: 2; Value: 10uF; Status: Preferred; Case: A; Mounted: Yes; Socket: No; SMD: Yes; Sense: No; ComponentHeight: 1.8mm; HelpURL: \\cern.ch\dfs\Applications\Altium\Datasheets\CTE_AVX_TCJ.pdf; Author: CERN DEM JLC; CreateDate: 29.03.2012; LatestRevisionDate: 29.03.2012
C224 = CC0603_22UF_6.3V_20%_X5R: Non-polarised capacitor; Manufacturer: GENERIC; Part Description: SMD Multilayer Chip Ceramic Capacitor; Manufacturer1 Part Number: C1608X5R0J226M080; Voltage: 6.3V; TC: X5R; Tolerance: ±20%; Part Number: CC0603_22UF_6.3V_20%_X5R; Component Kind: Standard; Component Type: Standard; Pin Count: 2; Value: 22uF; Status: None; Manufacturer Part Number: CC0603_22UF_6.3V_20%_X5R; Case: 0603; Mounted: Yes; Socket: No; SMD: Yes; Sense: No; Manufacturer1 Example: TDK; Manufacturer1 ComponentHeight: 0.9mm; HelpURL: \\cern.ch\dfs\Applications\Altium\Datasheets\CC0603_X5R_TDK_C.pdf; Author: CERN DEM JLC; CreateDate: 2013-12-16; LatestRevisionDate: 2020-12-03
C225 = CC0402_1UF_16V_10%_X5R: Non-polarised capacitor; Part Description: SMD Multilayer Chip Ceramic Capacitor; Manufacturer: GENERIC; Manufacturer1 Part Number: C1005X5R1C105KT; Voltage: 16V; TC: X5R; Tolerance: ±10%; Part Number: CC0402_1UF_16V_10%_X5R; Component Kind: Standard; Component Type: Standard; Pin Count: 2; Value: 1uF; Status: Preferred; Manufacturer Part Number: CC0402_1UF_16V_10%_X5R; Case: 0402; Mounted: Yes; Socket: No; SMD: Yes; Sense: No; Manufacturer1 Example: TDK; Manufacturer1 ComponentHeight: 0.55mm; HelpURL: \\cern.ch\dfs\Applications\Altium\Datasheets\CC0402_X5R_TDK_C.pdf; Author: CERN DEM JLC; CreateDate: 2012-10-25; LatestRevisionDate: 2012-10-25
D3 D4 D7 = BAT165: Schottky Diode; Manufacturer: INFINEON; Part Description: Medium Power AF Schottky Diode; Voltage: 40V; Power: 750mA; PressFit: No; Bonding: No; Manufacturer Part Number: BAT165; PackageDescription: Small Outline Diode (SOD-323), 1.70mm W X 1.25mm L X 1.10mm H body,  IPC Medium Density; Part Number: BAT165; Component Kind: Standard; Component Type: Standard; Device: BAT165; Pin Count: 2; Case: SOD323; Mounted: Yes; Socket: No; SMD: Yes; Sense: No; ComponentHeight: 1.1mm; HelpURL: \\cern.ch\dfs\Applications\Altium\Datasheets\BAT165.pdf; Author: CERN DEM JLC; CreateDate: 12.11.2014; LatestRevisionDate: 12.11.2014
D5 = PESD3V3L5UY: Fivefold ESD Protection Diode Arrays; Part Description: Fivefold ESD Protection Diode Arrays (30kV); Manufacturer: NEXPERIA; Voltage: 3.3V; Power: 200W; PressFit: No; Bonding: No; Part Number: PESD3V3L5UY; Component Kind: Standard; Component Type: Standard; Device: PESD3V3L5UY; PackageDescription: SOT363, SC-88, 0.65mm Pitch; 6 Pin, 1.25mm W X 2.00mm L X 1.10mm H body, IPC Medium Density; Manufacturer Part Number: PESD3V3L5UY; Pin Count: 6; Case: SOT363; Mounted: Yes; Socket: No; SMD: Yes; Sense: No; ComponentHeight: 1.1mm; HelpURL: \\cern.ch\dfs\Applications\Altium\Datasheets\PESD3V3L5UY.pdf; Author: CERN DEM WB; CreateDate: 05.07.2021; LatestRevisionDate: 05.07.2021
IC1 = TLC555ID: LinCMOS Timer; Manufacturer: TEXAS INSTRUMENTS; PressFit: No; Bonding: No; Part Number: TLC555ID; Component Kind: Standard; Component Type: Standard; Device: TLC555ID; PackageDescription: SOIC 8, Pitch 1.27mm, Body 4x5mm, IPC Medium Density; Part Description: LinCMOS Timer; Manufacturer Part Number: TLC555ID; Pin Count: 8; Case: SOIC8; Mounted: Yes; Socket: No; SMD: Yes; Sense: No; ComponentHeight: 1.75mm; Author: CERN DEM JMW; HelpURL: \\cern.ch\dfs\Applications\Altium\Datasheets\TLC555ID.pdf; CreateDate: 23.08.2016; LatestRevisionDate: 23.08.2016
IC23 = 74HC4066PW: Part Description: Quad Single-Pole Single-Throw Analog Switch; Manufacturer: NXP SEMICONDUCTORS; PressFit: No; Bonding: No; Table: Standard Logic; Part Number: 74HC4066PW; Component Kind: Standard; Component Type: Standard; Device: 74HC4066PW; PackageDescription: SOP, 14-Leads, Body 4.4x5mm (max), Pitch 0.65mm, IPC Medium Density; Manufacturer Part Number: 74HC4066PW; Pin Count: 14; Case: TSSOP14; Mounted: Yes; Socket: No; SMD: Yes; ComponentHeight: 1.1mm; Author: CERN DEM JLC; HelpURL: \\cern.ch\dfs\Applications\Altium\Datasheets\74HC4066PW.pdf; CreateDate: 2014-11-19; LatestRevisionDate: 2014-11-19
IC28 = MIC5219-3.3YM5: 500mA Peak Output LDO Regulator; Part Description: 3.3V 500mA Peak Output Low Drop-Out  (LDO) Regulator; Manufacturer: MICROCHIP TECHNOLOGY; PressFit: No; Bonding: No; Part Number: MIC5219-3.3YM5; Component Kind: Standard; Component Type: Standard; Device: MIC5219-3.3YM5; PackageDescription: SOT, 0.95mm pitch; 5 pin, 1.60mm W X 2.90mm L X 1.45mm H body, IPC Medium Density; Manufacturer Part Number: MIC5219-3.3YM5; Pin Count: 5; Case: SOT23-5; Mounted: Yes; Socket: No; SMD: Yes; Sense: No; ComponentHeight: 1.45mm; HelpURL: \\cern.ch\dfs\Applications\Altium\Datasheets\MIC5219-3.3YM5.pdf; Author: CERN DEM WB; CreateDate: 2019-04-16; LatestRevisionDate: 2019-04-16
J1 = AMPHENOL_10052837-101LF: 96 Contacts Header, 8 Columns, 4 Pairs per Column; Part Description: 96 Contacts, 2mm Pitch, 8 Columns, 4 Pairs per Column, 2 Walls, Right Angle Header; Part Number: AMPHENOL_10052837-101LF; Component Kind: Standard; Component Type: Standard; Pin Count: 96; Family: AirMax VS; Mounted: Yes; Socket: No; SMD: No; PressFit: Yes; Sense: No; Status: None; Manufacturer: AMPHENOL; Manufacturer Part Number: 10052837-101LF; ComponentHeight: 15.35mm; HelpURL: \\cern.ch\dfs\Applications\Altium\Datasheets\AMPHENOL_10052837-101LF.pdf; ComponentLink1URL: \\cern.ch\dfs\Applications\Altium\Datasheets\AMPHENOL_10052837-101LF_Application.pdf; ComponentLink1Description: Application; Author: CERN DEM MR; CreateDate: 19/02/2018; LatestRevisionDate: 19/02/2018
J8 = AMPHENOL_10052825-101LF: 72 Contacts Header, 6 Columns, 4 Pairs per Column; Part Description: 72 Contacts, 2mm Pitch, 6 Columns, 4 Pairs per Column, 4 Walls, Right Angle Header; Part Number: AMPHENOL_10052825-101LF; Component Kind: Standard; Component Type: Standard; Pin Count: 72; Family: AirMax VS; Mounted: Yes; Socket: No; SMD: No; PressFit: Yes; Sense: No; Status: None; Manufacturer: AMPHENOL; Manufacturer Part Number: 10052825-101LF; ComponentHeight: 15.35mm; HelpURL: \\cern.ch\dfs\Applications\Altium\Datasheets\AMPHENOL_10052825-101LF.pdf; ComponentLink1URL: \\cern.ch\dfs\Applications\Altium\Datasheets\AMPHENOL_10052825-101LF_Application.pdf; ComponentLink1Description: Application; Author: CERN DEM MR; CreateDate: 19/02/2018; LatestRevisionDate: 19/02/2018; Classname: Overlapping
J11 = AMPHENOL_10052838-101LF: 96 Contacts Header, 8 Columns, 4 Pairs per Column; Part Description: 96 Contacts, 2mm Pitch, 8 Columns, 4 Pairs per Column, 4 Walls, Right Angle Header; Part Number: AMPHENOL_10052838-101LF; Component Kind: Standard; Component Type: Standard; Pin Count: 96; Family: AirMax VS; Mounted: Yes; Socket: No; SMD: No; PressFit: Yes; Sense: No; Status: None; Manufacturer: AMPHENOL; Manufacturer Part Number: 10052838-101LF; ComponentHeight: 15.35mm; HelpURL: \\cern.ch\dfs\Applications\Altium\Datasheets\AMPHENOL_10052838-101LF.pdf; ComponentLink1URL: \\cern.ch\dfs\Applications\Altium\Datasheets\AMPHENOL_10052838-101LF_Application.pdf; ComponentLink1Description: Application; Author: CERN DEM MR; CreateDate: 19.02.2018; LatestRevisionDate: 19.02.2018
R1 R205 = R0402_22R_1%_0.0625W_100PPM: Resistor - 1%; Part Description: General Purpose Thick Film Chip Resistor; Manufacturer: GENERIC; Manufacturer1 Part Number: 232270672209L; PressFit: No; Part Number: R0402_22R_1%_0.0625W_100PPM; Component Kind: Standard; Component Type: Standard; Pin Count: 2; Value: 22; Status: Not Recommended; Power: 0.0625W; Tolerance: ±1%; Manufacturer Part Number: R0402_22R_1%_0.0625W_100PPM; Case: 0402; Mounted: Yes; Socket: No; SMD: Yes; Manufacturer1 Example: YAGEO PHYCOMP; Manufacturer1 ComponentHeight: 0.4mm; HelpURL: \\cern.ch\dfs\Applications\Altium\Datasheets\R0402_Phycomp_RC0402.pdf; Author: CERN DEM JLC; CreateDate: 03.12.2007; LatestRevisionDate: 17.10.2012; Sense: No
R5 R221 = R0402_0R_JUMPER: Resistor; Part Description: 1A (0.05R Max DC Resistance) Zero Ohm Jumper; Manufacturer: GENERIC; Manufacturer1 Part Number: 232270591001L; Part Number: R0402_0R_JUMPER; Component Kind: Standard; Component Type: Standard; Pin Count: 2; Value: 0; Status: Not recommended; Manufacturer Part Number: R0402_0R_JUMPER; Case: 0402; Mounted: Yes; Sense: No; Socket: No; SMD: Yes; Manufacturer1 Example: YAGEO PHYCOMP; Manufacturer1 ComponentHeight: 0.4mm; HelpURL: \\cern.ch\dfs\Applications\Altium\Datasheets\R0402_Phycomp_RC0402.pdf; Author: CERN DEM JLC; CreateDate: 03.12.2007; LatestRevisionDate: 17.10.2012
R220 R223-R225 R228 R229 R356 R357 = R0402_10K_1%_0.0625W_100PPM: Resistor - 1%; Part Description: General Purpose Thick Film Chip Resistor; Manufacturer: GENERIC; Manufacturer1 Part Number: 232270671003L; TC: ±100ppm/°C; PressFit: No; Part Number: R0402_10K_1%_0.0625W_100PPM; Component Kind: Standard; Component Type: Standard; Pin Count: 2; Value: 10k; Status: Not Recommended; Power: 0.0625W; Manufacturer Part Number: R0402_10K_1%_0.0625W_100PPM; Case: 0402; Mounted: Yes; Sense: No; Socket: No; SMD: Yes; Manufacturer1 Example: YAGEO PHYCOMP; Manufacturer1 ComponentHeight: 0.4mm; HelpURL: \\cern.ch\dfs\Applications\Altium\Datasheets\R0402_Phycomp_RC0402.pdf; Author: CERN DEM JLC; CreateDate: 2007-12-03; LatestRevisionDate: 2012-10-17
R222 R226 = R0603_2K7_1%_0.1W_100PPM: Resistor - 1%; Part Description: General Purpose Thick Film Chip Resistor; Manufacturer: GENERIC; Manufacturer1 Part Number: RC0603FR-072K7L; Power: 0.1W; TC: ±100ppm/°C; PressFit: No; Part Number: R0603_2K7_1%_0.1W_100PPM; Component Kind: Standard; Component Type: Standard; Pin Count: 2; Value: 2k7; Status: Preferred; Manufacturer Part Number: R0603_2K7_1%_0.1W_100PPM; Case: 0603; Mounted: Yes; Sense: No; Socket: No; SMD: Yes; Manufacturer1 Example: YAGEO PHYCOMP; Manufacturer1 ComponentHeight: 0.55mm; HelpURL: \\cern.ch\dfs\Applications\Altium\Datasheets\R0603_PHYCOMP_RC0603.pdf; Author: CERN DEM JLC; CreateDate: 2011-05-02; LatestRevisionDate: 2011-05-02
R298 = R0402_240R_1%_0.0625W_100PPM: Resistor - 1%; Part Description: General Purpose Thick Film Chip Resistor; Manufacturer: GENERIC; Manufacturer1 Part Number: 232270672401L; TC: ±100ppm/°C; PressFit: No; Part Number: R0402_240R_1%_0.0625W_100PPM; Component Kind: Standard; Component Type: Standard; Pin Count: 2; Value: 240; Status: Not Recommended; Power: 0.0625W; Tolerance: ±1%; Manufacturer Part Number: R0402_240R_1%_0.0625W_100PPM; Case: 0402; Mounted: Yes; Sense: No; Socket: No; SMD: Yes; Manufacturer1 Example: YAGEO PHYCOMP; Manufacturer1 ComponentHeight: 0.4mm; HelpURL: \\cern.ch\dfs\Applications\Altium\Datasheets\R0402_Phycomp_RC0402.pdf; Author: CERN DEM JLC; CreateDate: 03.12.2007; LatestRevisionDate: 17.10.2012
T10 T30 = BSS138LT1G: N-CHANNEL MOSFET WITH DIODE; Part Description: 50V 200mA N-Channel Enhancement Mode Field-Effect Transistor; Manufacturer: ON SEMICONDUCTOR; PressFit: No; Bonding: No; Part Number: BSS138LT1G; Component Kind: Standard; Component Type: Standard; Device: BSS138LT1G; PackageDescription: SOT23 3-Leads, Pitch 0.95mm - Body 1.4x3mm, IPC Medium Density; Manufacturer Part Number: BSS138LT1G; Pin Count: 3; Case: SOT23-3; Mounted: Yes; Socket: No; SMD: Yes; Sense: No; ComponentHeight: 1.11mm; HelpURL: \\cern.ch\dfs\Applications\Altium\Datasheets\BSS138LT1G.pdf; Author: CERN DEM JLC; CreateDate: 23.03.2009; LatestRevisionDate: 23.03.2009